# EAGLE schematic boardv2 (EAGLE 6.6.0)

## Sheet 1 of 5: FNR,Throttle
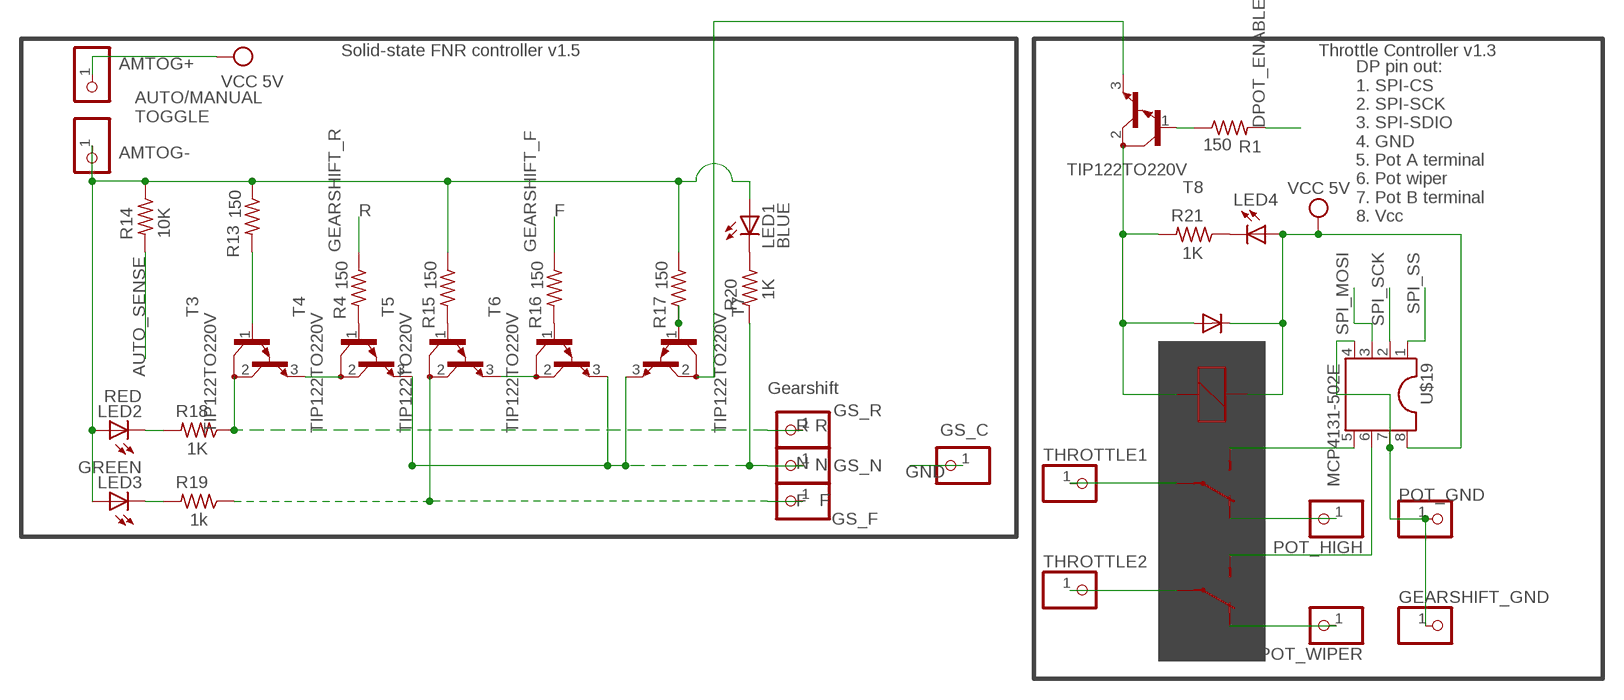
[diagram p0: schematic, sheet 1]

### Parts
AMTOG+  PINHD-1X1  [1X01]
AMTOG-  PINHD-1X1  [1X01]
D5  1N4004  [DO41-10]
GEARSHIFT_GND  PINHD-1X1  [1X01]
GS_C  N  PINHD-1X1  [1X01]
GS_F  F  PINHD-1X1  [1X01]
GS_N  N  PINHD-1X1  [1X01]
GS_R  R  PINHD-1X1  [1X01]
K1  G5V-2  [G5V-2]
LED1  BLUE  LED3MM  [LED3MM]
LED2  RED  LED3MM  [LED3MM]
LED3  GREEN  LED3MM  [LED3MM]
LED4  LED3MM  [LED3MM]
POT_GND  POT_GND  PINHD-1X1  [1X01]
POT_HIGH  PINHD-1X1  [1X01]
POT_WIPER  PINHD-1X1  [1X01]
R1  150  R-US_0204/5  [0204/5]
R4  150  R-US_0204/5  [0204/5]
R13  150  R-US_0204/5  [0204/5]
R14  10K  R-US_0204/5  [0204/5]
R15  150  R-US_0204/5  [0204/5]
R16  150  R-US_0204/5  [0204/5]
R17  150  R-US_0204/5  [0204/5]
R18  1K  R-US_0204/5  [0204/5]
R19  1k  R-US_0204/5  [0204/5]
R20  1K  R-US_0204/5  [0204/5]
R21  1K  R-US_0204/5  [0204/5]
T3  TIP122TO220V  [TO220V]
T4  TIP122TO220V  [TO220V]
T5  TIP122TO220V  [TO220V]
T6  TIP122TO220V  [TO220V]
T7  TIP122TO220V  [TO220V]
T8  TIP122TO220V  [TO220V]
THROTTLE1  PINHD-1X1  [1X01]
THROTTLE2  PINHD-1X1  [1X01]
U$19  MCP4131-502E  [SO8]

### Nets
+5V: AMTOG+.1 D5.C K1.1 LED4.A U$19.8(+5V) ; supply symbol labelled VCC 5V ; also sheet 2,3,4
AM_TOGGLE-: AMTOG-.1 LED1.A LED2.A LED3.A R13.1 R14.1 R15.1 R17.1 ; also sheet 3
AUTO_SENSE: R14.2 ; also sheet 3
DPOT_ENABLE: R1.2 ; also sheet 2,3
FGND: GS_F.1 R19.1 T5.2(C) ; also sheet 3
GEARSHIFT_F: R16.1 ; also sheet 2,3
GEARSHIFT_R: R4.1 ; also sheet 2,3
GND: GEARSHIFT_GND.1 GS_C.1 POT_GND.1 U$19.4(GND) U$19.7(A) ; also sheet 2,3,4
N: GS_N.1 R20.2 T4.3(E) T6.3(E) T7.3(E) ; also sheet 3
N$1: T7.2(C) T8.3(E)
N$2: R1.1 T8.1(B)
N$5: T3.3(E) T4.2(C)
N$8: LED1.K(C) R20.1
N$13: LED2.K(C) R18.2
N$14: LED3.K(C) R19.2
N$17: LED4.K(C) R21.1
N$18: R13.2 T3.1(B)
N$19: R4.2 T4.1(B)
N$20: R15.2 T5.1(B)
N$21: R16.2 T6.1(B)
N$22: T5.3(E) T6.2(C)
N$23: R17.2 T7.1(B)
N$51: K1.9(2:S) U$19.5(B)
N$52: K1.8(1:S) U$19.6(W)
N$57: D5.A K1.16 R21.2 T8.2(C)
POT_HIGH: K1.11(2:O) POT_HIGH.1 ; also sheet 3
POT_WIPER: K1.6(1:O) POT_WIPER.1 ; also sheet 3
RGND: GS_R.1 R18.1 T3.2(C) ; also sheet 3
SPI_MOSI: U$19.3(MOSI) ; also sheet 2,3
SPI_SCK: U$19.2(SCK) ; also sheet 2,3
SPI_SS: U$19.1(SS) ; also sheet 2,3
THROTTLE1: K1.13(2:P) THROTTLE1.1 ; also sheet 3
THROTTLE2: K1.4(1:P) THROTTLE2.1 ; also sheet 3

### Notes on the sheet
- Solid-state FNR controller v1.5 | Throttle Controller v1.3
- AUTO/MANUAL
  TOGGLE
- R | F
- DP pin out:
  1. SPI-CS
  2. SPI-SCK
  3. SPI-SDIO
  4. GND
  5. Pot A terminal
  6. Pot wiper
  7. Pot B terminal
  8. Vcc
- Gearshift
- R
  
  N
  
  F

## Sheet 2 of 5: Test points
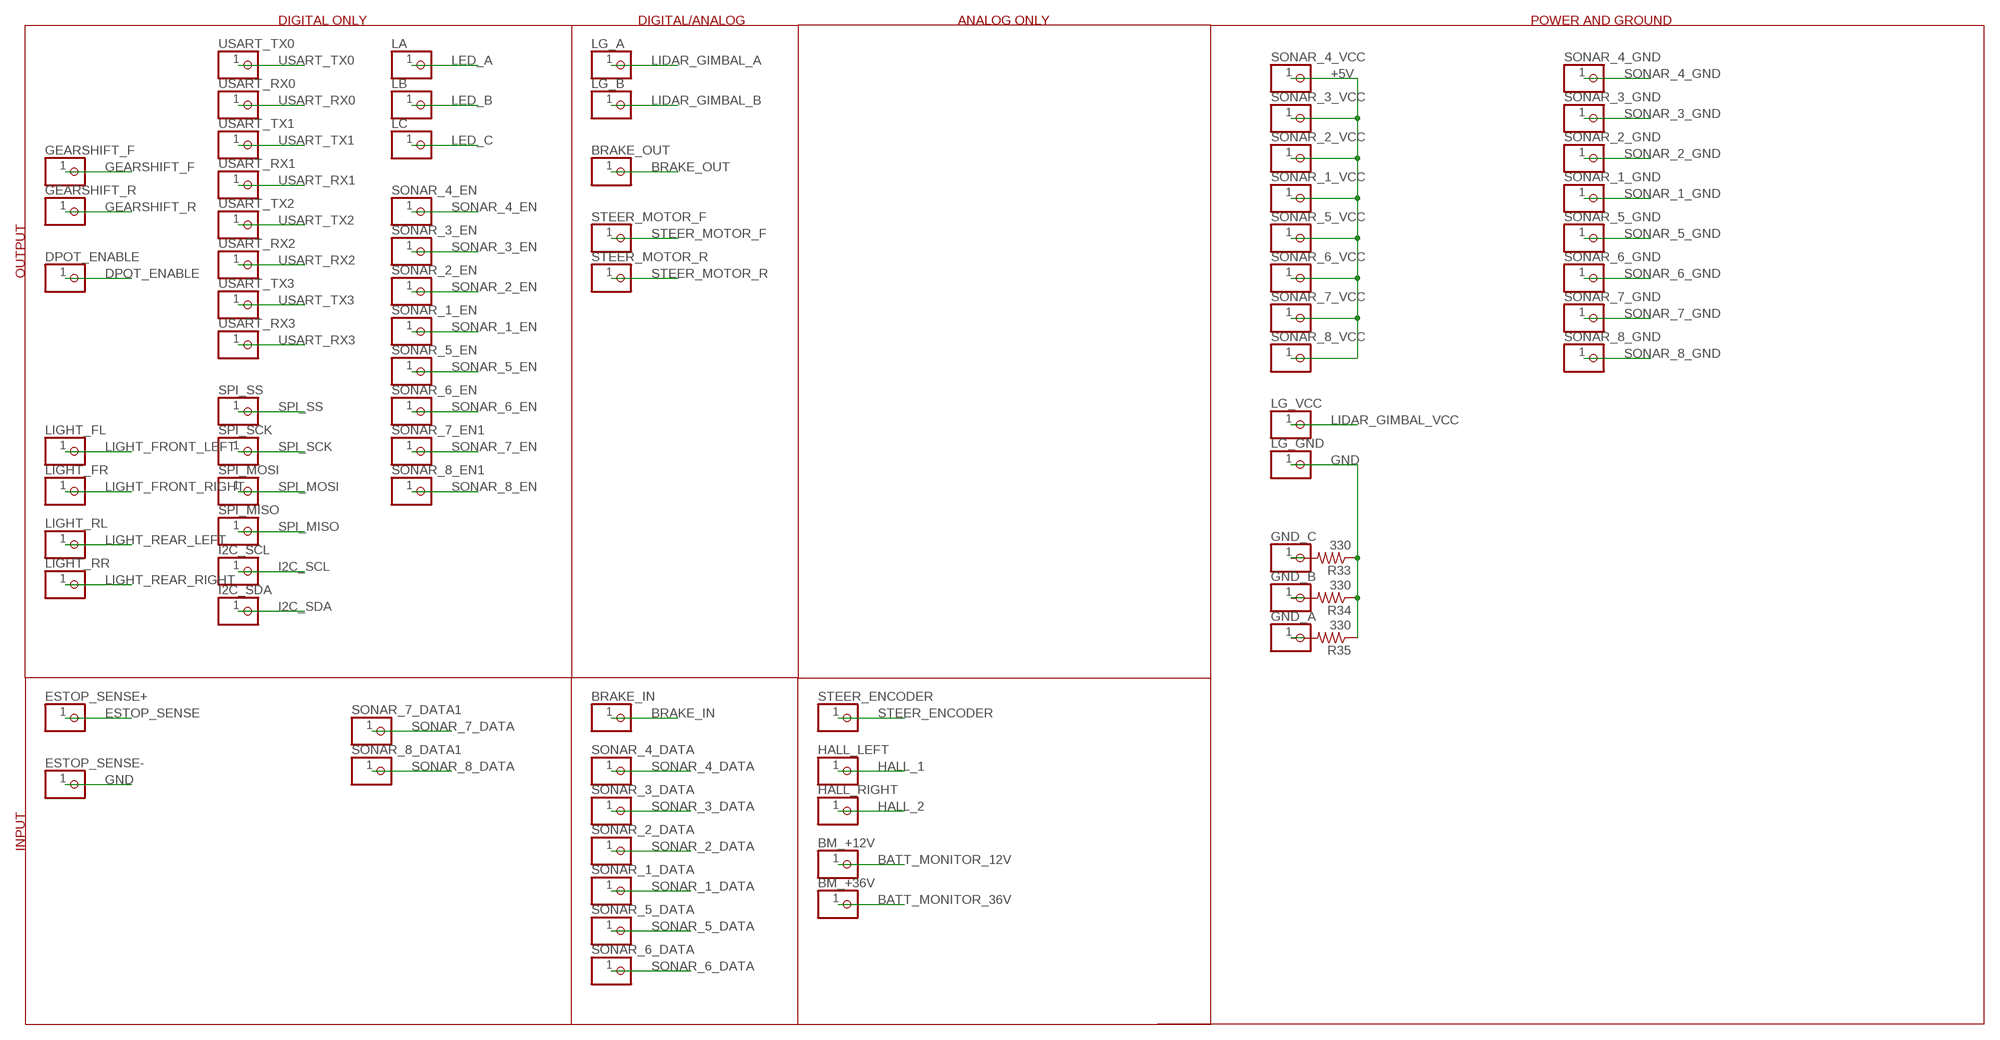
[diagram p1: schematic, sheet 2]

### Parts
BM_+12V  PINHD-1X1  [1X01]
BM_+36V  PINHD-1X1  [1X01]
BRAKE_IN  PINHD-1X1  [1X01]
BRAKE_OUT  PINHD-1X1  [1X01]
DPOT_ENABLE  PINHD-1X1  [1X01]
ESTOP_SENSE+  PINHD-1X1  [1X01]
ESTOP_SENSE-  PINHD-1X1  [1X01]
GEARSHIFT_F  PINHD-1X1  [1X01]
GEARSHIFT_R  PINHD-1X1  [1X01]
GND_A  PINHD-1X1  [1X01]
GND_B  PINHD-1X1  [1X01]
GND_C  PINHD-1X1  [1X01]
HALL_LEFT  PINHD-1X1  [1X01]
HALL_RIGHT  PINHD-1X1  [1X01]
I2C_SCL  PINHD-1X1  [1X01]
I2C_SDA  PINHD-1X1  [1X01]
LA  PINHD-1X1  [1X01]
LB  PINHD-1X1  [1X01]
LC  PINHD-1X1  [1X01]
LG_A  PINHD-1X1  [1X01]
LG_B  PINHD-1X1  [1X01]
LG_GND  PINHD-1X1  [1X01]
LG_VCC  PINHD-1X1  [1X01]
LIGHT_FL  PINHD-1X1  [1X01]
LIGHT_FR  PINHD-1X1  [1X01]
LIGHT_RL  PINHD-1X1  [1X01]
LIGHT_RR  PINHD-1X1  [1X01]
R33  330  R-US_R0603  [R0603]
R34  330  R-US_R0603  [R0603]
R35  330  R-US_R0603  [R0603]
SONAR_1_DATA  PINHD-1X1  [1X01]
SONAR_1_EN  PINHD-1X1  [1X01]
SONAR_1_GND  PINHD-1X1  [1X01]
SONAR_1_VCC  PINHD-1X1  [1X01]
SONAR_2_DATA  PINHD-1X1  [1X01]
SONAR_2_EN  PINHD-1X1  [1X01]
SONAR_2_GND  PINHD-1X1  [1X01]
SONAR_2_VCC  PINHD-1X1  [1X01]
SONAR_3_DATA  PINHD-1X1  [1X01]
SONAR_3_EN  PINHD-1X1  [1X01]
SONAR_3_GND  PINHD-1X1  [1X01]
SONAR_3_VCC  PINHD-1X1  [1X01]
SONAR_4_DATA  PINHD-1X1  [1X01]
SONAR_4_EN  PINHD-1X1  [1X01]
SONAR_4_GND  PINHD-1X1  [1X01]
SONAR_4_VCC  PINHD-1X1  [1X01]
SONAR_5_DATA  PINHD-1X1  [1X01]
SONAR_5_EN  PINHD-1X1  [1X01]
SONAR_5_GND  PINHD-1X1  [1X01]
SONAR_5_VCC  PINHD-1X1  [1X01]
SONAR_6_DATA  PINHD-1X1  [1X01]
SONAR_6_EN  PINHD-1X1  [1X01]
SONAR_6_GND  PINHD-1X1  [1X01]
SONAR_6_VCC  PINHD-1X1  [1X01]
SONAR_7_DATA1  PINHD-1X1  [1X01]
SONAR_7_EN1  PINHD-1X1  [1X01]
SONAR_7_GND  PINHD-1X1  [1X01]
SONAR_7_VCC  PINHD-1X1  [1X01]
SONAR_8_DATA1  PINHD-1X1  [1X01]
SONAR_8_EN1  PINHD-1X1  [1X01]
SONAR_8_GND  PINHD-1X1  [1X01]
SONAR_8_VCC  PINHD-1X1  [1X01]
SPI_MISO  PINHD-1X1  [1X01]
SPI_MOSI  PINHD-1X1  [1X01]
SPI_SCK  PINHD-1X1  [1X01]
SPI_SS  PINHD-1X1  [1X01]
STEER_ENCODER  PINHD-1X1  [1X01]
STEER_MOTOR_F  PINHD-1X1  [1X01]
STEER_MOTOR_R  PINHD-1X1  [1X01]
USART_RX0  PINHD-1X1  [1X01]
USART_RX1  PINHD-1X1  [1X01]
USART_RX2  PINHD-1X1  [1X01]
USART_RX3  PINHD-1X1  [1X01]
USART_TX0  PINHD-1X1  [1X01]
USART_TX1  PINHD-1X1  [1X01]
USART_TX2  PINHD-1X1  [1X01]
USART_TX3  PINHD-1X1  [1X01]

### Nets
+5V: SONAR_1_VCC.1 SONAR_2_VCC.1 SONAR_3_VCC.1 SONAR_4_VCC.1 SONAR_5_VCC.1 SONAR_6_VCC.1 SONAR_7_VCC.1 SONAR_8_VCC.1 ; also sheet 1,3,4
BATT_MONITOR_12V: BM_+12V.1 ; also sheet 3
BATT_MONITOR_36V: BM_+36V.1 ; also sheet 3
BRAKE_IN: BRAKE_IN.1 ; also sheet 3
BRAKE_OUT: BRAKE_OUT.1 ; also sheet 3
DPOT_ENABLE: DPOT_ENABLE.1 ; also sheet 1,3
ESTOP_SENSE: ESTOP_SENSE+.1 ; also sheet 3
GEARSHIFT_F: GEARSHIFT_F.1 ; also sheet 1,3
GEARSHIFT_R: GEARSHIFT_R.1 ; also sheet 1,3
GND: ESTOP_SENSE-.1 LG_GND.1 R33.1 R34.1 R35.1 ; also sheet 1,3,4
HALL_1: HALL_LEFT.1 ; also sheet 3
HALL_2: HALL_RIGHT.1 ; also sheet 3
I2C_SCL: I2C_SCL.1 ; also sheet 3
I2C_SDA: I2C_SDA.1 ; also sheet 3
LED_A: LA.1 ; also sheet 3
LED_B: LB.1 ; also sheet 3
LED_C: LC.1 ; also sheet 3
LIDAR_GIMBAL_A: LG_A.1 ; also sheet 3
LIDAR_GIMBAL_B: LG_B.1 ; also sheet 3
LIDAR_GIMBAL_VCC: LG_VCC.1 ; also sheet 3
LIGHT_FRONT_LEFT: LIGHT_FL.1 ; also sheet 3
LIGHT_FRONT_RIGHT: LIGHT_FR.1 ; also sheet 3
LIGHT_REAR_LEFT: LIGHT_RL.1 ; also sheet 3
LIGHT_REAR_RIGHT: LIGHT_RR.1 ; also sheet 3
N$24: GND_C.1 R33.2
N$26: GND_B.1 R34.2
N$27: GND_A.1 R35.2
SONAR_1_DATA: SONAR_1_DATA.1 ; also sheet 3
SONAR_1_EN: SONAR_1_EN.1 ; also sheet 3
SONAR_1_GND: SONAR_1_GND.1 ; also sheet 3
SONAR_2_DATA: SONAR_2_DATA.1 ; also sheet 3
SONAR_2_EN: SONAR_2_EN.1 ; also sheet 3
SONAR_2_GND: SONAR_2_GND.1 ; also sheet 3
SONAR_3_DATA: SONAR_3_DATA.1 ; also sheet 3
SONAR_3_EN: SONAR_3_EN.1 ; also sheet 3
SONAR_3_GND: SONAR_3_GND.1 ; also sheet 3
SONAR_4_DATA: SONAR_4_DATA.1 ; also sheet 3
SONAR_4_EN: SONAR_4_EN.1 ; also sheet 3
SONAR_4_GND: SONAR_4_GND.1 ; also sheet 3
SONAR_5_DATA: SONAR_5_DATA.1 ; also sheet 3
SONAR_5_EN: SONAR_5_EN.1 ; also sheet 3
SONAR_5_GND: SONAR_5_GND.1 ; also sheet 3
SONAR_6_DATA: SONAR_6_DATA.1 ; also sheet 3
SONAR_6_EN: SONAR_6_EN.1 ; also sheet 3
SONAR_6_GND: SONAR_6_GND.1 ; also sheet 3
SONAR_7_DATA: SONAR_7_DATA1.1 ; also sheet 3
SONAR_7_EN: SONAR_7_EN1.1 ; also sheet 3
SONAR_7_GND: SONAR_7_GND.1 ; also sheet 3
SONAR_8_DATA: SONAR_8_DATA1.1 ; also sheet 3
SONAR_8_EN: SONAR_8_EN1.1 ; also sheet 3
SONAR_8_GND: SONAR_8_GND.1 ; also sheet 3
SPI_MISO: SPI_MISO.1 ; also sheet 3
SPI_MOSI: SPI_MOSI.1 ; also sheet 1,3
SPI_SCK: SPI_SCK.1 ; also sheet 1,3
SPI_SS: SPI_SS.1 ; also sheet 1,3
STEER_ENCODER: STEER_ENCODER.1 ; also sheet 3
STEER_MOTOR_F: STEER_MOTOR_F.1 ; also sheet 3
STEER_MOTOR_R: STEER_MOTOR_R.1 ; also sheet 3
USART_RX0: USART_RX0.1 ; also sheet 3
USART_RX1: USART_RX1.1 ; also sheet 3
USART_RX2: USART_RX2.1 ; also sheet 3
USART_RX3: USART_RX3.1 ; also sheet 3
USART_TX0: USART_TX0.1 ; also sheet 3
USART_TX1: USART_TX1.1 ; also sheet 3
USART_TX2: USART_TX2.1 ; also sheet 3
USART_TX3: USART_TX3.1 ; also sheet 3

### Notes on the sheet
- DIGITAL ONLY | DIGITAL/ANALOG | ANALOG ONLY | POWER AND GROUND
- OUTPUT
- INPUT

## Sheet 3 of 5: Atmega,Communications,Connectors
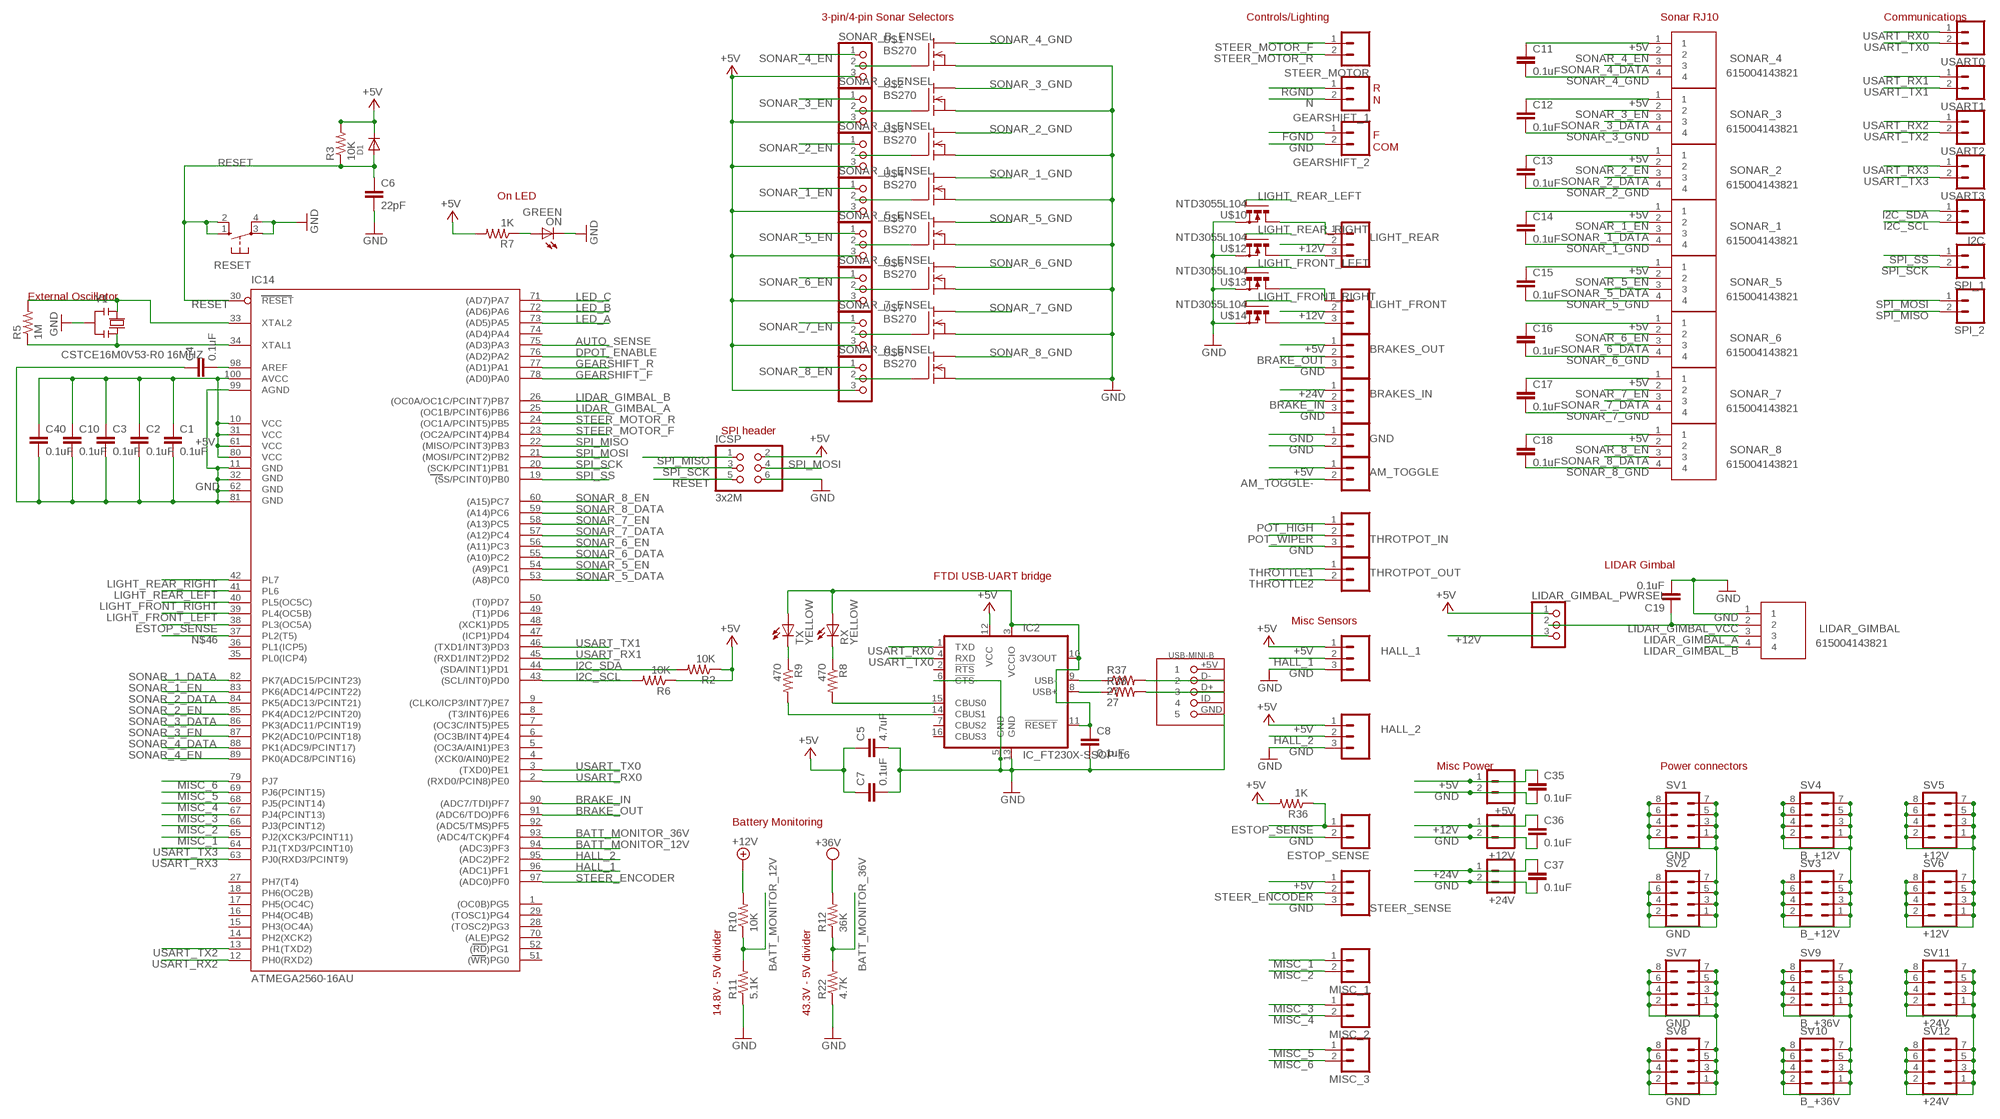
[diagram p2: schematic, sheet 3, part 1 of 2]
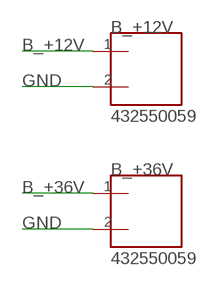
[diagram p3: schematic, sheet 3, part 2 of 2]

### Parts
+5V  M02  [02P]
+12V  M02  [02P]
+24V  M02  [02P]
AM_TOGGLE  M02  [02P]
B_+12V  432550059  [432550059]
B_+36V  432550059  [432550059]
BRAKES_IN  M03  [03P]
BRAKES_OUT  M03  [03P]
C1  0.1uF  C-EUC0603  [C0603]
C2  0.1uF  C-EUC0603  [C0603]
C3  0.1uF  C-EUC0603  [C0603]
C4  0.1uF  C-EUC0603  [C0603]
C5  4.7uF  C-EUC0603  [C0603]
C6  22pF  C-EUC0603  [C0603]
C7  0.1uF  C-EUC0603  [C0603]
C8  0.1uF  C-EUC0603  [C0603]
C10  0.1uF  C-EUC0603  [C0603]
C11  0.1uF  C-EUC0603  [C0603]
C12  0.1uF  C-EUC0603  [C0603]
C13  0.1uF  C-EUC0603  [C0603]
C14  0.1uF  C-EUC0603  [C0603]
C15  0.1uF  C-EUC0603  [C0603]
C16  0.1uF  C-EUC0603  [C0603]
C17  0.1uF  C-EUC0603  [C0603]
C18  0.1uF  C-EUC0603  [C0603]
C19  0.1uF  C-EUC0603  [C0603]
C35  0.1uF  C-EUC0603  [C0603]
C36  0.1uF  C-EUC0603  [C0603]
C37  0.1uF  C-EUC0603  [C0603]
C40  0.1uF  C-EUC0603  [C0603]
D1  DIODESOD-323F  [SOD-323F]
ESTOP_SENSE  M02  [02P]
GEARSHIFT_1  M02  [02P]
GEARSHIFT_2  M02  [02P]
GND  M02  [02P]
HALL_1  M03  [03P]
HALL_2  M03  [03P]
I2C  M02  [02P]
IC2  IC_FT230X-SSOP-16  [SSOP-16-FTDI]
IC14  ATMEGA2560-16AU  ATMEGA25602560-16AU  [TQFP100]
ICSP  3x2M  PINHD-2X3  [2X03]
LIDAR_GIMBAL  615004143821  [615004143821]
LIDAR_GIMBAL_PWRSEL  PINHD-1X3  [1X03]
LIGHT_FRONT  M03  [03P]
LIGHT_REAR  M03  [03P]
MISC_1  M02  [02P]
MISC_2  M02  [02P]
MISC_3  M02  [02P]
ON  GREEN  LEDCHIP-LED0603  [CHIP-LED0603]
R2  10K  R-US_R0603  [R0603]
R3  10K  R-US_R0603  [R0603]
R5  1M  R-US_R0603  [R0603]
R6  10K  R-US_R0603  [R0603]
R7  1K  R-US_R0603  [R0603]
R8  470  R-US_R0603  [R0603]
R9  470  R-US_R0603  [R0603]
R10  10K  R-US_R0603  [R0603]
R11  5.1K  R-US_R0603  [R0603]
R12  36K  R-US_R0603  [R0603]
R22  4.7K  R-US_R0603  [R0603]
R36  1K  R-US_R0603  [R0603]
R37  27  R-US_R0603  [R0603]
R38  27  R-US_R0603  [R0603]
RESET  10-XX  [B3F-10XX]
RX  YELLOW  LEDCHIP-LED0603  [CHIP-LED0603]
SONAR_1  615004143821  [615004143821]
SONAR_1_ENSEL  PINHD-1X3  [1X03]
SONAR_2  615004143821  [615004143821]
SONAR_2_ENSEL  PINHD-1X3  [1X03]
SONAR_3  615004143821  [615004143821]
SONAR_3_ENSEL  PINHD-1X3  [1X03]
SONAR_4  615004143821  [615004143821]
SONAR_5  615004143821  [615004143821]
SONAR_5_ENSEL  PINHD-1X3  [1X03]
SONAR_6  615004143821  [615004143821]
SONAR_6_ENSEL  PINHD-1X3  [1X03]
SONAR_7  615004143821  [615004143821]
SONAR_7_ENSEL  PINHD-1X3  [1X03]
SONAR_8  615004143821  [615004143821]
SONAR_8_ENSEL  PINHD-1X3  [1X03]
SONAR_B_ENSEL  PINHD-1X3  [1X03]
SPI_1  M02  [02P]
SPI_2  M02  [02P]
STEER_MOTOR  M02  [02P]
STEER_SENSE  M03  [03P]
SV1  GND  MA04-2  [MA04-2]
SV2  GND  MA04-2  [MA04-2]
SV3  B_+12V  MA04-2  [MA04-2]
SV4  B_+12V  MA04-2  [MA04-2]
SV5  +12V  MA04-2  [MA04-2]
SV6  +12V  MA04-2  [MA04-2]
SV7  GND  MA04-2  [MA04-2]
SV8  GND  MA04-2  [MA04-2]
SV9  B_+36V  MA04-2  [MA04-2]
SV10  B_+36V  MA04-2  [MA04-2]
SV11  +24V  MA04-2  [MA04-2]
SV12  +24V  MA04-2  [MA04-2]
THROTPOT_IN  M03  [03P]
THROTPOT_OUT  M02  [02P]
TX  YELLOW  LEDCHIP-LED0603  [CHIP-LED0603]
U$1  BS270  [TO92-DGS]
U$2  BS270  [TO92-DGS]
U$3  BS270  [TO92-DGS]
U$4  BS270  [TO92-DGS]
U$5  BS270  [TO92-DGS]
U$6  BS270  [TO92-DGS]
U$7  BS270  [TO92-DGS]
U$8  BS270  [TO92-DGS]
U$9  USB-MINI-B  [USB-MINI-B]
U$10  NTD3055L104  [TO220-GDS]
U$12  NTD3055L104  [TO220-GDS]
U$13  NTD3055L104  [TO220-GDS]
U$14  NTD3055L104  [TO220-GDS]
USART0  M02  [02P]
USART1  M02  [02P]
USART2  M02  [02P]
USART3  M02  [02P]
Y1  CSTCE16M0V53-R0 16MHZ  RESONATORMU  [RESONATOR]

### Nets
+3.3V: C8.1 IC2.3(VCCIO) IC2.10(3V3OUT) IC2.11(!RESET) RX.A TX.A
+5V: +5V.1 AM_TOGGLE.1 BRAKES_OUT.1 C1.1 C2.1 C3.1 C5.1 C7.1 C10.1 C11.1 C12.1 C13.1 C14.1 C15.1 C16.1 C17.1 C18.1 C35.1 C40.1 D1.C HALL_1.1 HALL_2.1 IC2.12(VCC) IC14.10(VCC) IC14.31(VCC1) IC14.61(VCC2) IC14.80(VCC3) IC14.100(AVCC) ICSP.2 LIDAR_GIMBAL_PWRSEL.1 R2.1 R3.2 R6.1 R7.2 R36.2 SONAR_1.1 SONAR_1_ENSEL.3 SONAR_2.1 SONAR_2_ENSEL.3 SONAR_3.1 SONAR_3_ENSEL.3 SONAR_4.1 SONAR_5.1 SONAR_5_ENSEL.3 SONAR_6.1 SONAR_6_ENSEL.3 SONAR_7.1 SONAR_7_ENSEL.3 SONAR_8.1 SONAR_8_ENSEL.3 SONAR_B_ENSEL.3 STEER_SENSE.1 ; also sheet 1,2,4
+12V: +12V.1 C36.1 LIDAR_GIMBAL_PWRSEL.3 LIGHT_FRONT.2 LIGHT_REAR.2 SV5.1 SV5.2 SV5.3 SV5.4 SV5.5 SV5.6 SV5.7 SV5.8 SV6.1 SV6.2 SV6.3 SV6.4 SV6.5 SV6.6 SV6.7 SV6.8
+24V: +24V.1 BRAKES_IN.1 C37.1 SV11.1 SV11.2 SV11.3 SV11.4 SV11.5 SV11.6 SV11.7 SV11.8 SV12.1 SV12.2 SV12.3 SV12.4 SV12.5 SV12.6 SV12.7 SV12.8
AM_TOGGLE-: AM_TOGGLE.2 ; also sheet 1
AUTO_SENSE: IC14.75((AD3)PA3) ; also sheet 1
B_+12V: B_+12V.1 R10.2 SV3.1 SV3.2 SV3.3 SV3.4 SV3.5 SV3.6 SV3.7 SV3.8 SV4.1 SV4.2 SV4.3 SV4.4 SV4.5 SV4.6 SV4.7 SV4.8 ; supply symbol labelled +12V ; also sheet 4
B_+36V: B_+36V.1 R12.2 SV9.1 SV9.2 SV9.3 SV9.4 SV9.5 SV9.6 SV9.7 SV9.8 SV10.1 SV10.2 SV10.3 SV10.4 SV10.5 SV10.6 SV10.7 SV10.8 ; supply symbol labelled +36V
BATT_MONITOR_12V: IC14.94((ADC3)PF3) R10.1 R11.2 ; also sheet 2
BATT_MONITOR_36V: IC14.93((ADC4/TCK)PF4) R12.1 R22.2 ; also sheet 2
BRAKE_IN: BRAKES_IN.2 IC14.90((ADC7/TDI)PF7) ; also sheet 2
BRAKE_OUT: BRAKES_OUT.2 IC14.91((ADC6/TDO)PF6) ; also sheet 2
DPOT_ENABLE: IC14.76((AD2)PA2) ; also sheet 1,2
ESTOP_SENSE: ESTOP_SENSE.1 IC14.38(PL3(OC5A)) R36.1 ; also sheet 2
FGND: GEARSHIFT_2.1 ; also sheet 1
GEARSHIFT_F: IC14.78((AD0)PA0) ; also sheet 1,2
GEARSHIFT_R: IC14.77((AD1)PA1) ; also sheet 1,2
GND: +5V.2 +12V.2 +24V.2 B_+12V.2 B_+36V.2 BRAKES_IN.3 BRAKES_OUT.3 C1.2 C2.2 C3.2 C4.1 C5.2 C6.2 C7.2 C8.2 C10.2 C19.2 C35.2 C36.2 C37.2 C40.2 ESTOP_SENSE.2 GEARSHIFT_2.2 GND.1 GND.2 HALL_1.3 HALL_2.3 IC2.5(GND) IC2.6(!CTS) IC2.13(GND) IC14.11(GND) IC14.32(GND1) IC14.62(GND2) IC14.81(GND3) IC14.99(AGND) ICSP.6 LIDAR_GIMBAL.1 ON.C R11.1 R22.1 RESET.3(P) RESET.4(P1) STEER_SENSE.3 SV1.1 SV1.2 SV1.3 SV1.4 SV1.5 SV1.6 SV1.7 SV1.8 SV2.1 SV2.2 SV2.3 SV2.4 SV2.5 SV2.6 SV2.7 SV2.8 SV7.1 SV7.2 SV7.3 SV7.4 SV7.5 SV7.6 SV7.7 SV7.8 SV8.1 SV8.2 SV8.3 SV8.4 SV8.5 SV8.6 SV8.7 SV8.8 THROTPOT_IN.3 U$1.S U$2.S U$3.S U$4.S U$5.S U$6.S U$7.S U$8.S U$9.GND U$10.S U$12.S U$13.S U$14.S Y1.2 ; also sheet 1,2,4
HALL_1: HALL_1.2 IC14.96((ADC1)PF1) ; also sheet 2
HALL_2: HALL_2.2 IC14.95((ADC2)PF2) ; also sheet 2
I2C_SCL: I2C.2 IC14.43((SCL/INT0)PD0) R6.2 ; also sheet 2
I2C_SDA: I2C.1 IC14.44((SDA/INT1)PD1) R2.2 ; also sheet 2
LED_A: IC14.73((AD5)PA5) ; also sheet 2
LED_B: IC14.72((AD6)PA6) ; also sheet 2
LED_C: IC14.71((AD7)PA7) ; also sheet 2
LIDAR_GIMBAL_A: IC14.25((OC1B/PCINT6)PB6) LIDAR_GIMBAL.3 ; also sheet 2
LIDAR_GIMBAL_B: IC14.26((OC0A/OC1C/PCINT7)PB7) LIDAR_GIMBAL.4 ; also sheet 2
LIDAR_GIMBAL_VCC: C19.1 LIDAR_GIMBAL.2 LIDAR_GIMBAL_PWRSEL.2 ; also sheet 2
LIGHT_FRONT_LEFT: IC14.39(PL4(OC5B)) U$13.G ; also sheet 2
LIGHT_FRONT_RIGHT: IC14.40(PL5(OC5C)) U$14.G ; also sheet 2
LIGHT_REAR_LEFT: IC14.41(PL6) U$10.G ; also sheet 2
LIGHT_REAR_RIGHT: IC14.42(PL7) U$12.G ; also sheet 2
MISC_1: IC14.65(PJ2(XCK3/PCINT11)) MISC_1.1
MISC_2: IC14.66(PJ3(PCINT12)) MISC_1.2
MISC_3: IC14.67(PJ4(PCINT13)) MISC_2.1
MISC_4: IC14.68(PJ5(PCINT14)) MISC_2.2
MISC_5: IC14.69(PJ6(PCINT15)) MISC_3.1
MISC_6: IC14.79(PJ7) MISC_3.2
N: GEARSHIFT_1.2 ; also sheet 1
N$3: SONAR_B_ENSEL.2 U$1.G
N$4: SONAR_2_ENSEL.2 U$2.G
N$6: SONAR_3_ENSEL.2 U$3.G
N$7: SONAR_1_ENSEL.2 U$4.G
N$9: SONAR_5_ENSEL.2 U$5.G
N$10: SONAR_6_ENSEL.2 U$6.G
N$11: SONAR_7_ENSEL.2 U$7.G
N$12: IC2.9(USB-) R37.1
N$15: SONAR_8_ENSEL.2 U$8.G
N$16: C4.2 IC14.98(AREF)
N$25: ON.A R7.1
N$28: IC14.34(XTAL1) R5.1 Y1.3
N$29: IC14.33(XTAL2) R5.2 Y1.1
N$30: LIGHT_FRONT.3 U$14.D
N$31: IC2.15(CBUS0) R8.2
N$32: IC2.14(CBUS1) R9.2
N$33: R9.1 TX.C
N$34: R8.1 RX.C
N$35: IC2.8(USB+) R38.1
N$36: R37.2 U$9.D-
N$39: R38.2 U$9.D+
N$44: LIGHT_REAR.1 U$10.D
N$46: IC14.37(PL2(T5))
N$56: LIGHT_REAR.3 U$12.D
N$58: LIGHT_FRONT.1 U$13.D
POT_HIGH: THROTPOT_IN.1 ; also sheet 1
POT_WIPER: THROTPOT_IN.2 ; also sheet 1
RESET: C6.1 D1.A IC14.30(RESET) ICSP.5 R3.1 RESET.1(S) RESET.2(S1)
RGND: GEARSHIFT_1.1 ; also sheet 1
SONAR_1_DATA: IC14.82(PK7(ADC15/PCINT23)) SONAR_1.3 ; also sheet 2
SONAR_1_EN: IC14.83(PK6(ADC14/PCINT22)) SONAR_1.2 SONAR_1_ENSEL.1 ; also sheet 2
SONAR_1_GND: C14.2 SONAR_1.4 U$4.D ; also sheet 2
SONAR_2_DATA: IC14.84(PK5(ADC13/PCINT21)) SONAR_2.3 ; also sheet 2
SONAR_2_EN: IC14.85(PK4(ADC12/PCINT20)) SONAR_2.2 SONAR_3_ENSEL.1 ; also sheet 2
SONAR_2_GND: C13.2 SONAR_2.4 U$3.D ; also sheet 2
SONAR_3_DATA: IC14.86(PK3(ADC11/PCINT19)) SONAR_3.3 ; also sheet 2
SONAR_3_EN: IC14.87(PK2(ADC10/PCINT18)) SONAR_2_ENSEL.1 SONAR_3.2 ; also sheet 2
SONAR_3_GND: C12.2 SONAR_3.4 U$2.D ; also sheet 2
SONAR_4_DATA: IC14.88(PK1(ADC9/PCINT17)) SONAR_4.3 ; also sheet 2
SONAR_4_EN: IC14.89(PK0(ADC8/PCINT16)) SONAR_4.2 SONAR_B_ENSEL.1 ; also sheet 2
SONAR_4_GND: C11.2 SONAR_4.4 U$1.D ; also sheet 2
SONAR_5_DATA: IC14.53((A8)PC0) SONAR_5.3 ; also sheet 2
SONAR_5_EN: IC14.54((A9)PC1) SONAR_5.2 SONAR_5_ENSEL.1 ; also sheet 2
SONAR_5_GND: C15.2 SONAR_5.4 U$5.D ; also sheet 2
SONAR_6_DATA: IC14.55((A10)PC2) SONAR_6.3 ; also sheet 2
SONAR_6_EN: IC14.56((A11)PC3) SONAR_6.2 SONAR_6_ENSEL.1 ; also sheet 2
SONAR_6_GND: C16.2 SONAR_6.4 U$6.D ; also sheet 2
SONAR_7_DATA: IC14.57((A12)PC4) SONAR_7.3 ; also sheet 2
SONAR_7_EN: IC14.58((A13)PC5) SONAR_7.2 SONAR_7_ENSEL.1 ; also sheet 2
SONAR_7_GND: C17.2 SONAR_7.4 U$7.D ; also sheet 2
SONAR_8_DATA: IC14.59((A14)PC6) SONAR_8.3 ; also sheet 2
SONAR_8_EN: IC14.60((A15)PC7) SONAR_8.2 SONAR_8_ENSEL.1 ; also sheet 2
SONAR_8_GND: C18.2 SONAR_8.4 U$8.D ; also sheet 2
SPI_MISO: IC14.22((MISO/PCINT3)PB3) ICSP.1 SPI_2.2 ; also sheet 2
SPI_MOSI: IC14.21((MOSI/PCINT2)PB2) ICSP.4 SPI_2.1 ; also sheet 1,2
SPI_SCK: IC14.20((SCK/PCINT1)PB1) ICSP.3 SPI_1.2 ; also sheet 1,2
SPI_SS: IC14.19((SS/PCINT0)PB0) SPI_1.1 ; also sheet 1,2
STEER_ENCODER: IC14.97((ADC0)PF0) STEER_SENSE.2 ; also sheet 2
STEER_MOTOR_F: IC14.23((OC2A/PCINT4)PB4) STEER_MOTOR.1 ; also sheet 2
STEER_MOTOR_R: IC14.24((OC1A/PCINT5)PB5) STEER_MOTOR.2 ; also sheet 2
THROTTLE1: THROTPOT_OUT.1 ; also sheet 1
THROTTLE2: THROTPOT_OUT.2 ; also sheet 1
USART_RX0: IC2.1(TXD) IC14.2((RXD0/PCIN8)PE0) USART0.1 ; also sheet 2
USART_RX1: IC14.45((RXD1/INT2)PD2) USART1.1 ; also sheet 2
USART_RX2: IC14.12(PH0(RXD2)) USART2.1 ; also sheet 2
USART_RX3: IC14.63(PJ0(RXD3/PCINT9)) USART3.1 ; also sheet 2
USART_TX0: IC2.4(RXD) IC14.3((TXD0)PE1) USART0.2 ; also sheet 2
USART_TX1: IC14.46((TXD1/INT3)PD3) USART1.2 ; also sheet 2
USART_TX2: IC14.13(PH1(TXD2)) USART2.2 ; also sheet 2
USART_TX3: IC14.64(PJ1(TXD3/PCINT10)) USART3.2 ; also sheet 2
Unconnected: IC2.2(!RTS) IC2.7(CBUS2) IC2.16(CBUS3) IC14.1((OC0B)PG5) IC14.4((XCK0/AIN0)PE2) IC14.5((OC3A/AIN1)PE3) IC14.6((OC3B/INT4)PE4) IC14.7((OC3C/INT5)PE5) IC14.8((T3/INT6)PE6) IC14.9((CLKO/ICP3/INT7)PE7) IC14.14(PH2(XCK2)) IC14.15(PH3(OC4A)) IC14.16(PH4(OC4B)) IC14.17(PH5(OC4C)) IC14.18(PH6(OC2B)) IC14.27(PH7(T4)) IC14.28((TOSC2)PG3) IC14.29((TOSC1)PG4) IC14.35(PL0(ICP4)) IC14.36(PL1(ICP5)) IC14.47((ICP1)PD4) IC14.48((XCK1)PD5) IC14.49((T1)PD6) IC14.50((T0)PD7) IC14.51((WR)PG0) IC14.52((RD)PG1) IC14.70((ALE)PG2) IC14.74((AD4)PA4) IC14.92((ADC5/TMS)PF5) U$9.+5V U$9.ID

### Notes on the sheet
- 3-pin/4-pin Sonar Selectors | Controls/Lighting | Sonar RJ10 | Communications
- R
  N
  
  
  F
  COM
- On LED
- External Oscillator
- SPI header
- LIDAR Gimbal
- FTDI USB-UART bridge
- Misc Sensors
- Misc Power | Power connectors
- Battery Monitoring
- 14.8V - 5V divider | 43.3V - 5V divider

## Sheet 4 of 5: Power 12V to 5V@5A
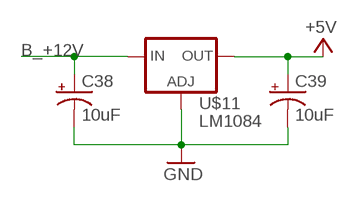
[diagram p4: schematic, sheet 4]

### Parts
C38  10uF  CPOL-USB45181B  [B45181B]
C39  10uF  CPOL-USB45181B  [B45181B]
U$11  LM1084  [TO220V]

### Nets
+5V: C39.+ U$11.2(OUT) ; also sheet 1,2,3
B_+12V: C38.+ U$11.3(IN) ; also sheet 3
GND: C38.- C39.- U$11.1(ADJ) ; also sheet 1,2,3

## Sheet 5 of 5
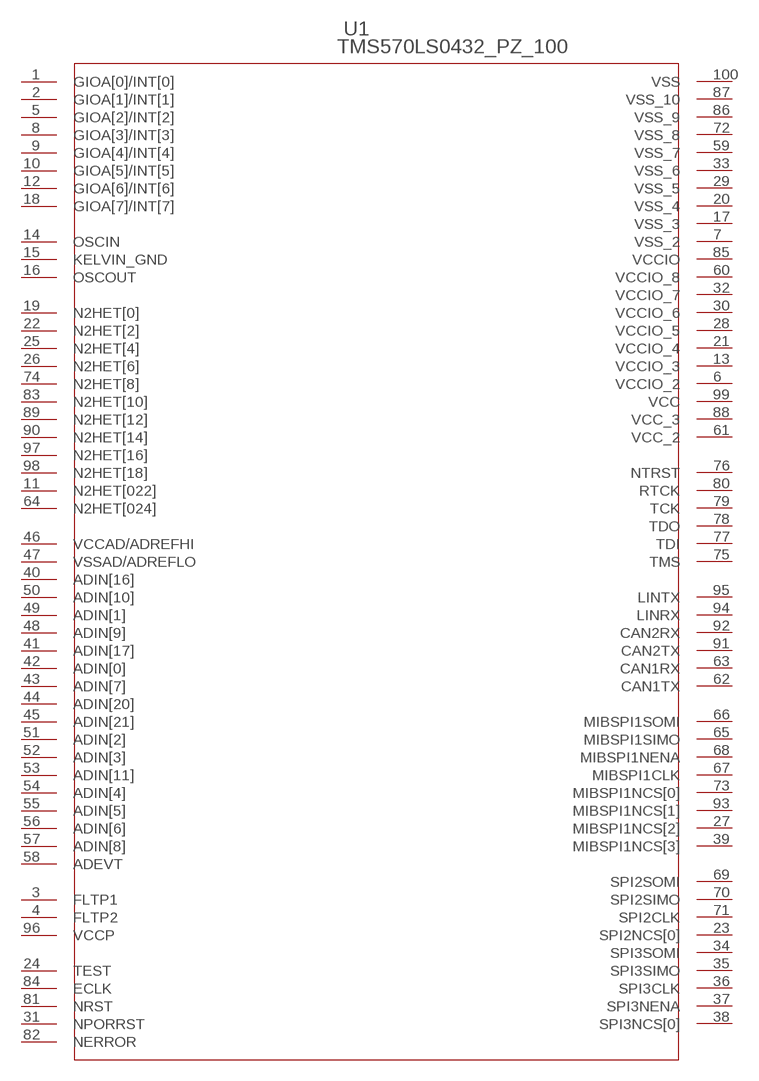
[diagram p5: schematic, sheet 5]

### Parts
U1  TMS570LS0432_PZ_100  [PZ100]
Unconnected: U1.1(GIOA[0]/INT[0]) U1.2(GIOA[1]/INT[1]) U1.3(FLTP1) U1.4(FLTP2) U1.5(GIOA[2]/INT[2]) U1.8(GIOA[3]/INT[3]) U1.9(GIOA[4]/INT[4]) U1.10(GIOA[5]/INT[5]) U1.11(N2HET[022]) U1.12(GIOA[6]/INT[6]) U1.15(KELVIN_GND) U1.16(OSCOUT) U1.18(GIOA[7]/INT[7]) U1.19(N2HET[0]) U1.22(N2HET[2]) U1.23(SPI2NCS[0]) U1.24(TEST) U1.25(N2HET[4]) U1.26(N2HET[6]) U1.27(MIBSPI1NCS[2]) U1.31(NPORRST) U1.34(SPI3SOMI) U1.35(SPI3SIMO) U1.36(SPI3CLK) U1.37(SPI3NENA) U1.38(SPI3NCS[0]) U1.39(MIBSPI1NCS[3]) U1.40(ADIN[16]) U1.41(ADIN[17]) U1.42(ADIN[0]) U1.43(ADIN[7]) U1.44(ADIN[20]) U1.45(ADIN[21]) U1.46(VCCAD/ADREFHI) U1.47(VSSAD/ADREFLO) U1.48(ADIN[9]) U1.49(ADIN[1]) U1.50(ADIN[10]) U1.51(ADIN[2]) U1.52(ADIN[3]) U1.53(ADIN[11]) U1.54(ADIN[4]) U1.55(ADIN[5]) U1.56(ADIN[6]) U1.57(ADIN[8]) U1.58(ADEVT) U1.62(CAN1TX) U1.63(CAN1RX) U1.64(N2HET[024]) U1.65(MIBSPI1SIMO) U1.66(MIBSPI1SOMI) U1.67(MIBSPI1CLK) U1.68(MIBSPI1NENA) U1.69(SPI2SOMI) U1.70(SPI2SIMO) U1.71(SPI2CLK) U1.73(MIBSPI1NCS[0]) U1.74(N2HET[8]) U1.75(TMS) U1.76(NTRST) U1.77(TDI) U1.78(TDO) U1.79(TCK) U1.80(RTCK) U1.81(NRST) U1.82(NERROR) U1.83(N2HET[10]) U1.84(ECLK) U1.89(N2HET[12]) U1.90(N2HET[14]) U1.91(CAN2TX) U1.92(CAN2RX) U1.93(MIBSPI1NCS[1]) U1.94(LINRX) U1.95(LINTX) U1.97(N2HET[16]) U1.98(N2HET[18])

## Power pins joined to a net without a drawn wire
OSCIN: U1.14(OSCIN)
VCC: U1.99(VCC)
VCC_2: U1.61(VCC_2)
VCC_3: U1.88(VCC_3)
VCCIO: U1.85(VCCIO)
VCCIO_2: U1.6(VCCIO_2)
VCCIO_3: U1.13(VCCIO_3)
VCCIO_4: U1.21(VCCIO_4)
VCCIO_5: U1.28(VCCIO_5)
VCCIO_6: U1.30(VCCIO_6)
VCCIO_7: U1.32(VCCIO_7)
VCCIO_8: U1.60(VCCIO_8)
VCCP: U1.96(VCCP)
VSS: U1.100(VSS)
VSS_2: U1.7(VSS_2)
VSS_3: U1.17(VSS_3)
VSS_4: U1.20(VSS_4)
VSS_5: U1.29(VSS_5)
VSS_6: U1.33(VSS_6)
VSS_7: U1.59(VSS_7)
VSS_8: U1.72(VSS_8)
VSS_9: U1.86(VSS_9)
VSS_10: U1.87(VSS_10)

## Library data of the parts
+5V +12V +24V AM_TOGGLE ESTOP_SENSE GEARSHIFT_1 GEARSHIFT_2 GND I2C MISC_1-MISC_3 SPI_1 SPI_2 STEER_MOTOR THROTPOT_OUT USART0 USART1-USART3 = con-amp-quick:M02: AMP QUICK CONNECTOR; OC_FARNELL: unknown; OC_NEWARK: unknown
AMTOG+ AMTOG- BM_+12V BM_+36V BRAKE_IN BRAKE_OUT DPOT_ENABLE ESTOP_SENSE+ ESTOP_SENSE- GEARSHIFT_F GEARSHIFT_GND GEARSHIFT_R GND_A GND_B GND_C GS_C GS_F GS_N GS_R HALL_LEFT HALL_RIGHT I2C_SCL I2C_SDA LA LB LC LG_A LG_B LG_GND LG_VCC LIGHT_FL LIGHT_FR LIGHT_RL LIGHT_RR POT_GND POT_HIGH POT_WIPER SONAR_1_DATA SONAR_1_EN SONAR_1_GND SONAR_1_VCC SONAR_2_DATA SONAR_2_EN SONAR_2_GND SONAR_2_VCC SONAR_3_DATA SONAR_3_EN SONAR_3_GND SONAR_3_VCC SONAR_4_DATA SONAR_4_EN SONAR_4_GND SONAR_4_VCC SONAR_5_DATA SONAR_5_EN SONAR_5_GND SONAR_5_VCC SONAR_6_DATA SONAR_6_EN SONAR_6_GND SONAR_6_VCC SONAR_7_DATA1 SONAR_7_EN1 SONAR_7_GND SONAR_7_VCC SONAR_8_DATA1 SONAR_8_EN1 SONAR_8_GND SONAR_8_VCC SPI_MISO SPI_MOSI SPI_SCK SPI_SS STEER_ENCODER STEER_MOTOR_F STEER_MOTOR_R THROTTLE1 THROTTLE2 USART_RX0 USART_RX1-USART_RX3 USART_TX0 USART_TX1-USART_TX3 = adafruit:PINHD-1X1: Pin header 1x1 for 0.1" spacing With round pins
B_+12V B_+36V = custom:432550059
BRAKES_IN BRAKES_OUT HALL_1 HALL_2 LIGHT_FRONT LIGHT_REAR STEER_SENSE THROTPOT_IN = con-amp-quick:M03: AMP QUICK CONNECTOR; OC_FARNELL: unknown; OC_NEWARK: unknown
C1-C8 C10-C19 C35-C37 C40 = rcl:C-EU: CAPACITOR, European symbol
C38 C39 = adafruit:CPOL-US: POLARIZED CAPACITOR, American symbol
D1 = adafruit:DIODE: Diode SMADIODE - SMA Surface Mount Package 20V 1A Schottky Diode Digikey: 641-1014-6-ND DO-1N4148 - Through Hole Small Current Diode SOD-123 20V 1 A (.5mV Vf) Schottky Diode - Digikey: MBRX120TPMSCT-ND SOD-323 10V 570mA (.38mV Vf, 3ns) Schottky Diode - Digikey: ZLLS410CT-ND SOD-523 30V 30mA Schottky Diode (RB751S-40TE61) - Digikey: RB751S-40TE61CT-ND SOT23-R/W - SOT23 Package (R = Solder Paste/Reflow Ovens, W = Hand-Soldering) BAT54Film 40V 300mA - Digikey: 497-7162-1-ND
D5 = adafruit:1N4004: DIODE General purpose 1N400x type rectifier (With bigger pads) http://www.ladyada.net/library/pcb/eaglelibrary.html
IC2 = dp_devices:IC_FT230X: BASIC USB to UART IC
IC14 = SmartPrj2:ATMEGA2560: MICROCONTROLLER 64/128/256 Kbytes FLASH 4 Kbytes EEPROM 8 Kbytes SRAM 86 General Purpose I/O pins 12-channels16-bit PWM 4 x Serial USARTs 16-channels 10-bit A/D
ICSP = SmartPrj:PINHD-2X3: PIN HEADER
K1 = relay:G5V-2: OMRON PCB Relay Source: http://www.omron.com/ecb/products/pdf/en-g5v2.pdf; MPN: G5V-2 5DC; OC_FARNELL: 9949488; OC_NEWARK: 78K5703
LED1-LED4 = adafruit:LED: LED
LIDAR_GIMBAL SONAR_1-SONAR_8 = ModularJackstehendungeschirmtWR-MJ:615004143821: WR-MJ Horizontal Plastic 4P4C Modular Jack Tab Up, 4 Pins
LIDAR_GIMBAL_PWRSEL SONAR_1_ENSEL SONAR_2_ENSEL SONAR_3_ENSEL SONAR_5_ENSEL SONAR_6_ENSEL SONAR_7_ENSEL SONAR_8_ENSEL SONAR_B_ENSEL = adafruit:PINHD-1X3: PIN HEADER
ON RX TX = led:LED: LED
R1 R4 R13-R21 = rcl:R-US_: RESISTOR, American symbol
R2 R3 R5-R12 R22 R33-R38 = resistor:R-US_: RESISTOR, American symbol
RESET = switch-omron:10-XX: OMRON SWITCH; MPN: B3F-1000; OC_FARNELL: 176432; OC_NEWARK: 36M3542
SV1-SV12 = con-lstb:MA04-2: PIN HEADER; OC_FARNELL: unknown; OC_NEWARK: unknown
T3-T8 = transistor modified:TIP122: NPN BIPOLAR DARLINGTON TRANSISTOR
U1 = version2:TMS570LS0432_PZ_100; MANUFACTURER_PART_NUMBER: tms570ls0432_pz_100; VENDOR: TEXAS INSTRUMENTS
U$1-U$8 = custom:BS270: BS270 DGS
U$9 = custom:USB-MINI-B: USB mini B, PCB through hole mount.
U$10 U$12-U$14 = custom:NTD3055L104
U$11 = custom:LM1084
U$19 = custom:MCP4131-502E
Y1 = SmartPrj:RESONATOR

## Net classes
0 default: width 0.203 mm, drill 0.406 mm, clearance 0.102 mm
1 power: width 0.203 mm, drill 0.406 mm, clearance 0.203 mm
2 gnd: width 0.203 mm, drill 0.406 mm, clearance 0.203 mm
3 power usb: width 0.508 mm, drill 0.406 mm, clearance 0.203 mm